# Altium schematic sheet SCHEM_POWER_MOD.SchDoc
size A4; SheetNumber: 1; SheetTotal: 1
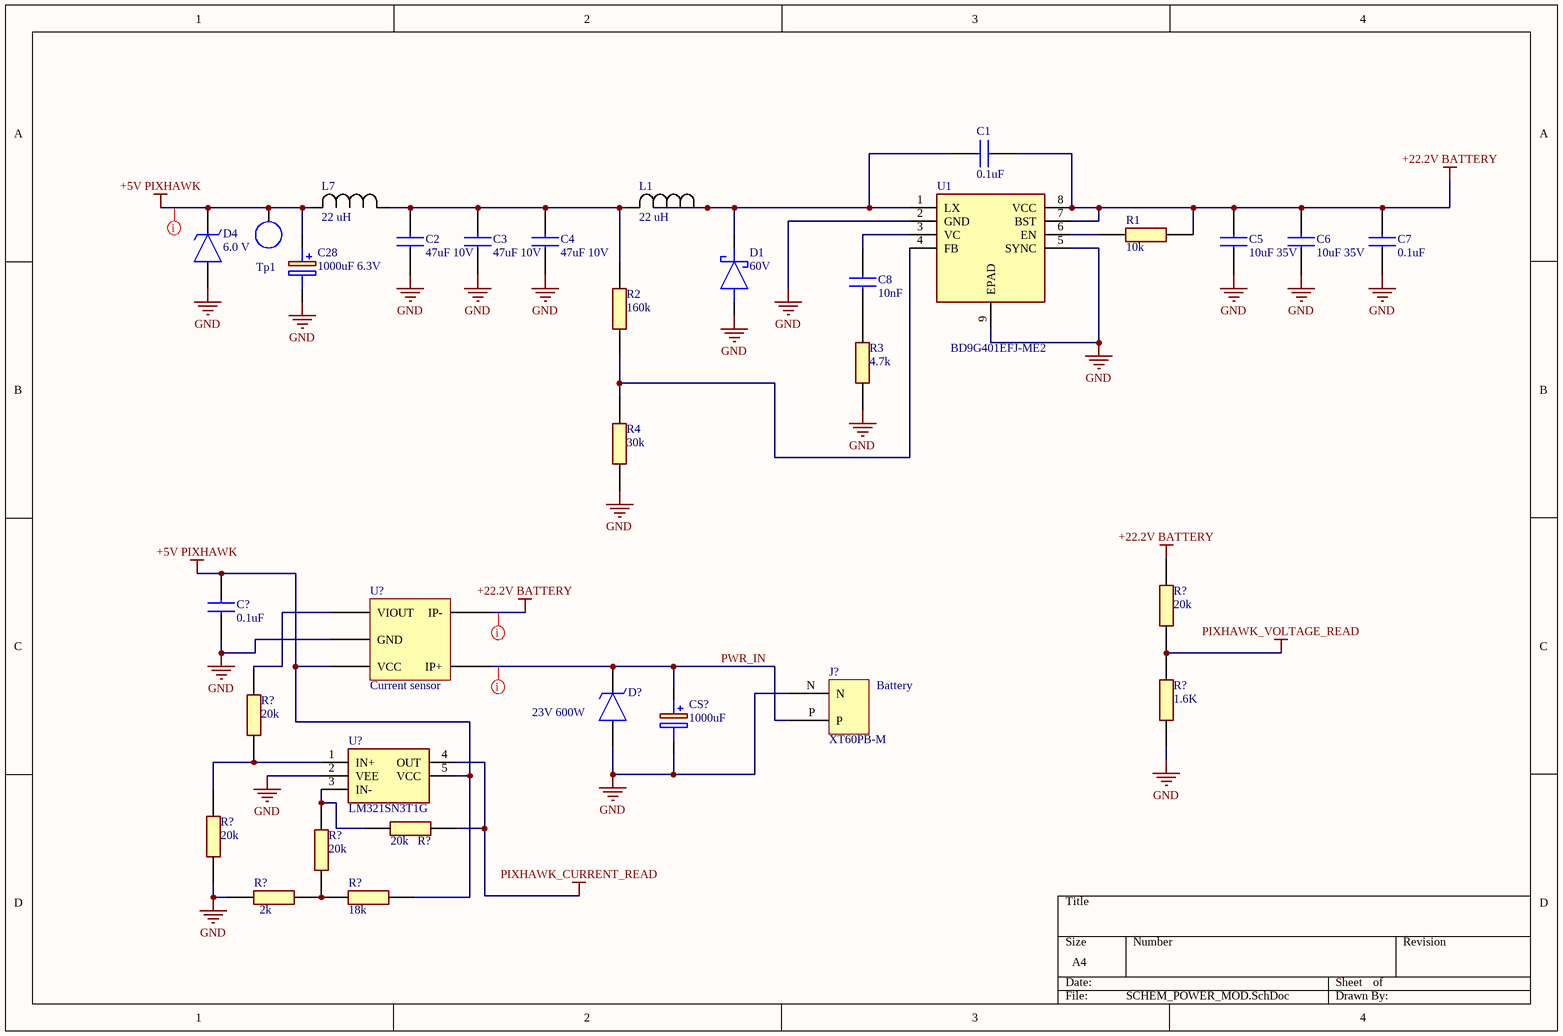
[diagram p0: SCHEM_POWER_MOD.SchDoc]

## Parts
(Parts that share a designator on the sheet are numbered #1, #2 ... from top to bottom, then left to right.)
C1  0.1uF  [CAPC2012X145N]
C2  47uF 10V  [CAPC2012X145N]
C3  47uF 10V  [CAPC2012X145N]
C4  47uF 10V  [CAPC2012X145N]
C5  10uF 35V  [CAPC2012X145N]
C6  10uF 35V  [CAPC2012X145N]
C7  0.1uF  [CAPC2012X145N]
C8  10nF  [CAPC2012X145N]
C28  1000uF 6.3V  [CAPAE830X1050N]
C?  0.1uF  [CAPC2012X145N]
CS?  1000uF  [CAPPRD500W60D1025H2150]
D1  60V  [SODFL4725X105N]
D4  6.0 V  [SMBJ12A]
D?  23V 600W  [SM6F22AY]
J?  XT60PB-M  [XT60PB-M]
L1  22 uH  [IND_104CDMCCDS_SUM]
L7  22 uH  [IND_104CDMCCDS_SUM]
R1  10k  [RESC2012X60N]
R2  160k  [RESC2012X60N]
R3  4.7k  [RESC2012X60N]
R4  30k  [RESC2012X60N]
R?#1  20k  [RESC2012X50N]
R?#2  1.6K  [RESC2012X60N]
R?#3  20k  [RESC2012X50N]
R?#4  20k  [RESC2012X50N]
R?#5  20k  [RESC2012X50N]
R?#6  2k  [RESC2012X60N]
R?#7  18k  [RESC2012X50N]
R?#8  20k  [RESC2012X50N]
Tp1  Testpoint  [Testpoint]  (value not drawn)  (no BOM)
U1  BD9G401EFJ-ME2  [SOIC127P600X100-9N]
U?#1  Current sensor  [ACS770xCB-PFF - Sans Via-in-Pad]
U?#2  LM321SN3T1G  [SOT95P275X110-5N]

## Nets
+5V PIXHAWK: C28.1(+) C?.2 D4.1(K) L7.2 R?#7.2 Tp1.TP U?#1.1(VCC) U?#2.5(VCC)
+22.2V BATTERY: C1.2 C5.2 C6.2 C7.2 R1.2 R?#1.1 U1.7(BST) U1.8(VCC) U?#1.5(IP-)
GND: C2.1 C3.1 C4.1 C5.1 C6.1 C7.1 C28.2(-) C?.1 CS?.2(-) D1.2(A) D4.2(A) D?.2(A) J?.N R3.1 R4.1 R?#2.1 R?#5.1 R?#6.1 U1.2(GND) U1.5(SYNC) U1.9(EPAD) U?#1.2(GND) U?#2.2(VEE)
PIXHAWK_CURRENT_READ: R?#4.1 U?#2.4(OUT)
PIXHAWK_VOLTAGE_READ: R?#1.2 R?#2.2
PWR_IN: CS?.1(+) D?.1(K) J?.P U?#1.4(IP+)
NetC1_1: C1.1 D1.1(K) L1.1 U1.1(LX)
NetC2_2: C2.2 C3.2 C4.2 L1.2 L7.1 R2.2
NetC8_1: C8.1 R3.2
NetC8_2: C8.2 U1.3(VC)
NetR1_1: R1.1 U1.6(EN)
NetR2_1: R2.1 R4.2 U1.4(FB)
NetR?#3_1: R?#3.1 R?#5.2 U?#2.1(IN+)
NetR?#3_2: R?#3.2 U?#1.3(VIOUT)
NetR?#4_2: R?#4.2 R?#8.2 U?#2.3(IN-)
NetR?#6_2: R?#6.2 R?#7.1 R?#8.1

## Layout directives
rule Supply Nets [Voltage = 5.000]: +5V PIXHAWK
rule Supply Nets [Voltage = 22.20]: +22.2V BATTERY, PWR_IN

## Notes on the sheet
- (near J?) Battery

## Library data of the parts
C1 C7 C? = C2012X7R2A104K125AA: Capacitor; Manufacturer_Name: TDK; Datasheet Link: https://product.tdk.com/info/en/catalog/datasheets/mlcc_commercial_midvoltage_en.pdf; Height: 1.45mm; Manufacturer_Part_Number: C2012X7R2A104K125AA; Mouser Part Number: 810-C2012X7R2A104K; Mouser Price/Stock: https://www.mouser.co.uk/ProductDetail/TDK/C2012X7R2A104K125AA?qs=NRhsANhppD9J0ZsT2%2Fo%2F7Q%3D%3D; Arrow Part Number: C2012X7R2A104K125AA; Arrow Price/Stock: https://www.arrow.com/en/products/c2012x7r2a104k125aa/tdk?region=europe; ClassName: PowerModul
C2-C4 = C2012X5R1A476M125AC: Capacitor; Manufacturer_Name: TDK; Datasheet Link: https://product.tdk.com/info/en/catalog/datasheets/mlcc_commercial_midvoltage_en.pdf; Height: 1.45mm; Manufacturer_Part_Number: C2012X5R1A476M125AC; Mouser Part Number: 810-C2012X5R1A476M; Mouser Price/Stock: https://www.mouser.co.uk/ProductDetail/TDK/C2012X5R1A476M125AC?qs=LcTL%2F5vFEzGyFw5hxP%2FMXw%3D%3D; Arrow Part Number: C2012X5R1A476M125AC; Arrow Price/Stock: https://www.arrow.com/en/products/c2012x5r1a476m125ac/tdk?region=nac; ClassName: PowerModul
C5 C6 = C2012X5R1V106K125AC: Capacitor; Manufacturer_Name: TDK; Datasheet Link: https://product.tdk.com/info/en/catalog/datasheets/mlcc_commercial_midvoltage_en.pdf; Height: 1.45mm; Manufacturer_Part_Number: C2012X5R1V106K125AC; Mouser Part Number: 810-C2012X5R1V106K1C; Mouser Price/Stock: https://www.mouser.co.uk/ProductDetail/TDK/C2012X5R1V106K125AC?qs=6JAMGB%252BEdkwcwonKbQLeCg%3D%3D; Arrow Part Number: C2012X5R1V106K125AC; Arrow Price/Stock: https://www.arrow.com/en/products/c2012x5r1v106k125ac/tdk?region=europe; ClassName: PowerModul
C8 = C2012X7R2E103K125AA: Capacitor; Manufacturer_Name: TDK; Datasheet Link: https://product.tdk.com/info/en/catalog/datasheets/mlcc_commercial_midvoltage_en.pdf; Height: 1.45mm; Manufacturer_Part_Number: C2012X7R2E103K125AA; Mouser Part Number: 810-C2012X7R2E103K; Mouser Price/Stock: https://www.mouser.co.uk/ProductDetail/TDK/C2012X7R2E103K125AA?qs=NRhsANhppD%2FvPjIeAxskbg%3D%3D; Arrow Part Number: C2012X7R2E103K125AA; Arrow Price/Stock: https://www.arrow.com/en/products/c2012x7r2e103k125aa/tdk?region=nac; ClassName: PowerModul
C28 = UCD0J102MNL1GS: Capacitor Polarised; Manufacturer_Name: Nichicon; Datasheet Link: https://www.nichicon.co.jp/english/products/pdfs/e-ucd.pdf; Height: 10.5mm; Manufacturer_Part_Number: UCD0J102MNL1GS; Mouser Part Number: 647-UCD0J102MNL1GS; Mouser Price/Stock: https://www.mouser.co.uk/ProductDetail/Nichicon/UCD0J102MNL1GS?qs=c0uEScvPYN2yS0opD8R0vQ%3D%3D; Arrow Part Number: UCD0J102MNL1GS; Arrow Price/Stock: https://www.arrow.com/en/products/ucd0j102mnl1gs/nichicon
CS? = 35PX1000MEFC10X20: Capacitor Polarised; Manufacturer_Name: Rubycon; Datasheet Link: https://www.rubycon.co.jp/wp-content/uploads/catalog-aluminum/PX.pdf; Height: 21.5mm; Manufacturer_Part_Number: 35PX1000MEFC10X20; Mouser Part Number: 232-35PX1000MEFC10X2; Mouser Price/Stock: https://www.mouser.co.uk/ProductDetail/Rubycon/35PX1000MEFC10X20?qs=T3oQrply3y86%2F1qnNfO%252BAA%3D%3D; Arrow Part Number: 35PX1000MEFC10X20; Arrow Price/Stock: https://www.arrow.com/en/products/35px1000mefc10x20/rubycon?region=nac
D1 = RBR5LAM60ATFTR: Schottky Diode; Manufacturer_Name: ROHM Semiconductor; Datasheet Link: https://fscdn.rohm.com/en/products/databook/datasheet/discrete/diode/schottky_barrier/rbr5lam60atftr-e.pdf; Height: 1.05mm; Manufacturer_Part_Number: RBR5LAM60ATFTR; Mouser Part Number: 755-RBR5LAM60ATFTR; Mouser Price/Stock: https://www.mouser.co.uk/ProductDetail/ROHM-Semiconductor/RBR5LAM60ATFTR?qs=4v%252BiZTmLVHGKJkO8tMW4zA%3D%3D; ClassName: PowerModul
D4 = SMBJ6.0A: TVS Diode (Uni-directional); Manufacturer_Name: STMicroelectronics; Datasheet Link: https://www.st.com/resource/en/datasheet/smbj12a.pdf; Height: 2.45mm; Manufacturer_Part_Number: SMBJ6.0A
D? = SM6F23AY: TVS Diode (Uni-directional); Manufacturer_Name: STMicroelectronics; Datasheet Link: https://www.st.com/resource/en/datasheet/sm6f10ay.pdf; Height: 1.03mm; Manufacturer_Part_Number: SM6F23AY; Mouser Part Number: 511-SM6F23AY; Mouser Price/Stock: https://www.mouser.co.uk/ProductDetail/STMicroelectronics/SM6F23AY?qs=BJlw7L4Cy79cZKdhit2Bog%3D%3D
J? = XT60PB-M: Connector; ComponentLink1Description: Datasheet; ComponentLink1URL: https://www.tme.com/Document/ceb306d6300f4d2860483975b79af125/XT60UPB-M.pdf
L1 L7 = 104CDMCCDS-220MC: Bobine de 22 uH, 5 A; Manufacturer_Name: Sumida; Type: Fixed Inductors; Copyright: Copyright (C) 2025 Ultra Librarian. All rights reserved.; Manufacturer_Part_Number: 104CDMCCDS-220MC; ComponentLink1Description: Datasheet; ComponentLink1URL: https://products.sumida.com/products/pdf/104CDMCCDS.pdf
R1 = CRCW080510K0FKEAHP: Resistor; Manufacturer_Name: Vishay; Datasheet Link: https://componentsearchengine.com/Datasheets/1/CRCW08051R00FKEAHP.pdf; Height: 0.6mm; Manufacturer_Part_Number: CRCW080510K0FKEAHP; Mouser Part Number: 71-CRCW080510K0FKEAH; Mouser Price/Stock: https://www.mouser.co.uk/ProductDetail/Vishay-Dale/CRCW080510K0FKEAHP?qs=FlFvgi4rxBybVOW6oiRQjA%3D%3D; Arrow Part Number: CRCW080510K0FKEAHP; Arrow Price/Stock: https://www.arrow.com/en/products/crcw080510k0fkeahp/vishay?utm_currency=USD&region=europe; ClassName: PowerModul
R2 = CRCW0805160KFKEAHP: Resistor; Manufacturer_Name: Vishay; Datasheet Link: https://componentsearchengine.com/Datasheets/1/CRCW08051R00FKEAHP.pdf; Height: 0.6mm; Manufacturer_Part_Number: CRCW0805160KFKEAHP; ClassName: PowerModul
R3 = CRCW08054K70FKEAC: Resistor; Manufacturer_Name: Vishay; Datasheet Link: https://mouser.componentsearchengine.com/Datasheets/1/CRCW08054K70FKEAC.pdf; Height: 0.6mm; Manufacturer_Part_Number: CRCW08054K70FKEAC; Mouser Part Number: 71-CRCW08054K70FKEAC; Mouser Price/Stock: https://www.mouser.co.uk/ProductDetail/Vishay-Dale/CRCW08054K70FKEAC?qs=E3Y5ESvWgWOQAAVugewEHA%3D%3D; Arrow Part Number: CRCW08054K70FKEAC; Arrow Price/Stock: https://www.arrow.com/en/products/crcw08054k70fkeac/vishay?region=nac; ClassName: PowerModul
R4 = CRCW080530K0FKEAC: Resistor; Manufacturer_Name: Vishay; Datasheet Link: https://mouser.componentsearchengine.com/Datasheets/1/CRCW080530K0FKEAC.pdf; Height: 0.6mm; Manufacturer_Part_Number: CRCW080530K0FKEAC; Mouser Part Number: 71-CRCW080530K0FKEAC; Mouser Price/Stock: https://www.mouser.co.uk/ProductDetail/Vishay-Dale/CRCW080530K0FKEAC?qs=E3Y5ESvWgWMYq9MgiyaMow%3D%3D; Arrow Part Number: CRCW080530K0FKEAC; Arrow Price/Stock: https://www.arrow.com/en/products/crcw080530k0fkeac/vishay?region=nac; ClassName: PowerModul
R?#1 R?#3-R?#5 R?#8 = CRCW080520K0FKEA: Resistor; Manufacturer_Name: Vishay; Datasheet Link: http://www.vishay.com/docs/20035/dcrcwe3.pdf; Height: 0.5mm; Manufacturer_Part_Number: CRCW080520K0FKEA; Mouser Part Number: 71-CRCW0805-20K-E3; Mouser Price/Stock: https://www.mouser.co.uk/ProductDetail/Vishay-Dale/CRCW080520K0FKEA?qs=t6Mf8e9K%2Ful9pWSqXxFD1w%3D%3D; Arrow Part Number: CRCW080520K0FKEA; Arrow Price/Stock: https://www.arrow.com/en/products/crcw080520k0fkea/vishay
R?#2 = CRCW08051K60FKEAC: Resistor; Manufacturer_Name: Vishay; Datasheet Link: https://www.arrow.com/en/products/crcw08051k60fkeac/vishay; Height: 0.6mm; Manufacturer_Part_Number: CRCW08051K60FKEAC; Mouser Part Number: 71-CRCW08051K60FKEAC; Mouser Price/Stock: https://www.mouser.co.uk/ProductDetail/Vishay-Dale/CRCW08051K60FKEAC?qs=E3Y5ESvWgWMJaZYHQus8LQ%3D%3D; Arrow Part Number: CRCW08051K60FKEAC; Arrow Price/Stock: https://www.arrow.com/en/products/crcw08051k60fkeac/vishay
R?#6 = CRCW08052K00FKEAC: Resistor; Manufacturer_Name: Vishay; Datasheet Link: http://www.vishay.com/docs/28773/crcwce3.pdf; Height: 0.6mm; Manufacturer_Part_Number: CRCW08052K00FKEAC; Mouser Part Number: 71-CRCW08052K00FKEAC; Mouser Price/Stock: https://www.mouser.co.uk/ProductDetail/Vishay-Dale/CRCW08052K00FKEAC?qs=E3Y5ESvWgWP6floxGsbShA%3D%3D; Arrow Part Number: CRCW08052K00FKEAC; Arrow Price/Stock: https://www.arrow.com/en/products/crcw08052k00fkeac/vishay?utm_currency=USD&region=nac
R?#7 = CRCW080518K0FKEAC: Resistor; Manufacturer_Name: Vishay; Datasheet Link: https://www.arrow.com/en/products/crcw080518k0fkeac/vishay?region=nac; Height: 0.5mm; Manufacturer_Part_Number: CRCW080518K0FKEAC; Mouser Part Number: 71-CRCW080518K0FKEAC; Mouser Price/Stock: https://www.mouser.co.uk/ProductDetail/Vishay-Dale/CRCW080518K0FKEAC?qs=E3Y5ESvWgWPSwNx6fNHotQ%3D%3D; Arrow Part Number: CRCW080518K0FKEAC; Arrow Price/Stock: https://www.arrow.com/en/products/crcw080518k0fkeac/vishay?region=nac
U1 = BD9G401EFJ-ME2: Integrated Circuit; Manufacturer_Name: ROHM Semiconductor; Datasheet Link: https://componentsearchengine.com/Datasheets/1/BD9G401EFJ-ME2.pdf; Height: 1mm; Manufacturer_Part_Number: BD9G401EFJ-ME2; Mouser Part Number: 755-BD9G401EFJ-ME2; Mouser Price/Stock: https://www.mouser.co.uk/ProductDetail/ROHM-Semiconductor/BD9G401EFJ-ME2?qs=HXFqYaX1Q2yXryPBxafgDg%3D%3D
U?#1 = ACS770KCB-150U-PFF-T: 150 A , Unidirectional; ComponentLink1Description: Datasheet; ComponentLink1URL: https://www.allegromicro.com/~/media/Files/Datasheets/ACS770-Datasheet.ashx
U?#2 = LM321SN3T1G: Integrated Circuit; Manufacturer_Name: onsemi; Datasheet Link: https://www.onsemi.com/pub/Collateral/LM321-D.PDF; Height: 1.1mm; Manufacturer_Part_Number: LM321SN3T1G; Mouser Part Number: 863-LM321SN3T1G; Mouser Price/Stock: https://www.mouser.co.uk/ProductDetail/onsemi/LM321SN3T1G?qs=slMPpRTKD5qNVsCzBsHVZA%3D%3D; Arrow Part Number: LM321SN3T1G; Arrow Price/Stock: https://www.arrow.com/en/products/lm321sn3t1g/on-semiconductor?utm_currency=USD&region=nac